# Altium schematic sheet microSD_Display.SchDoc
size A2; SheetNumber: 3; SheetTotal: 3
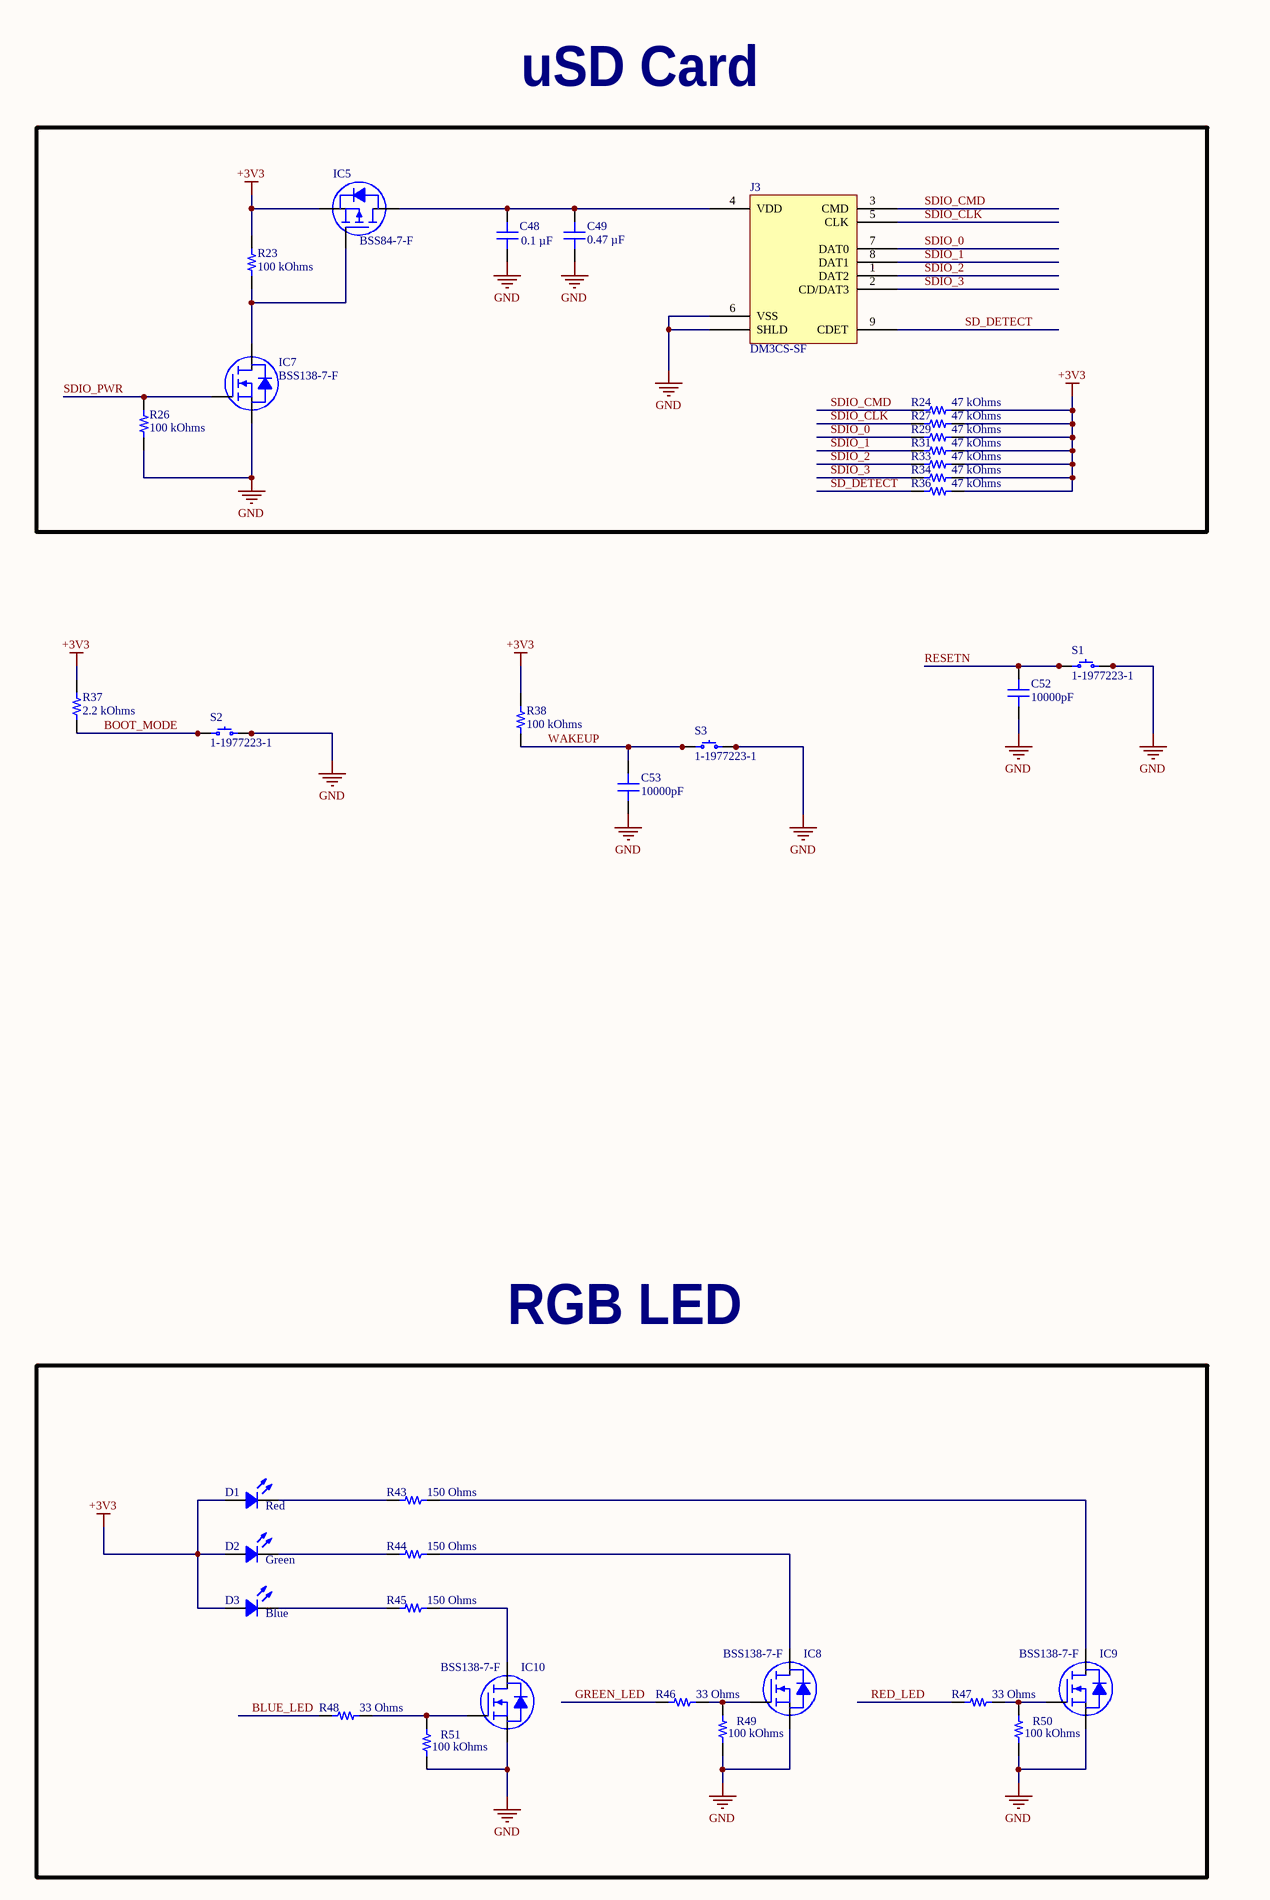
[diagram p0: microSD_Display.SchDoc, left]
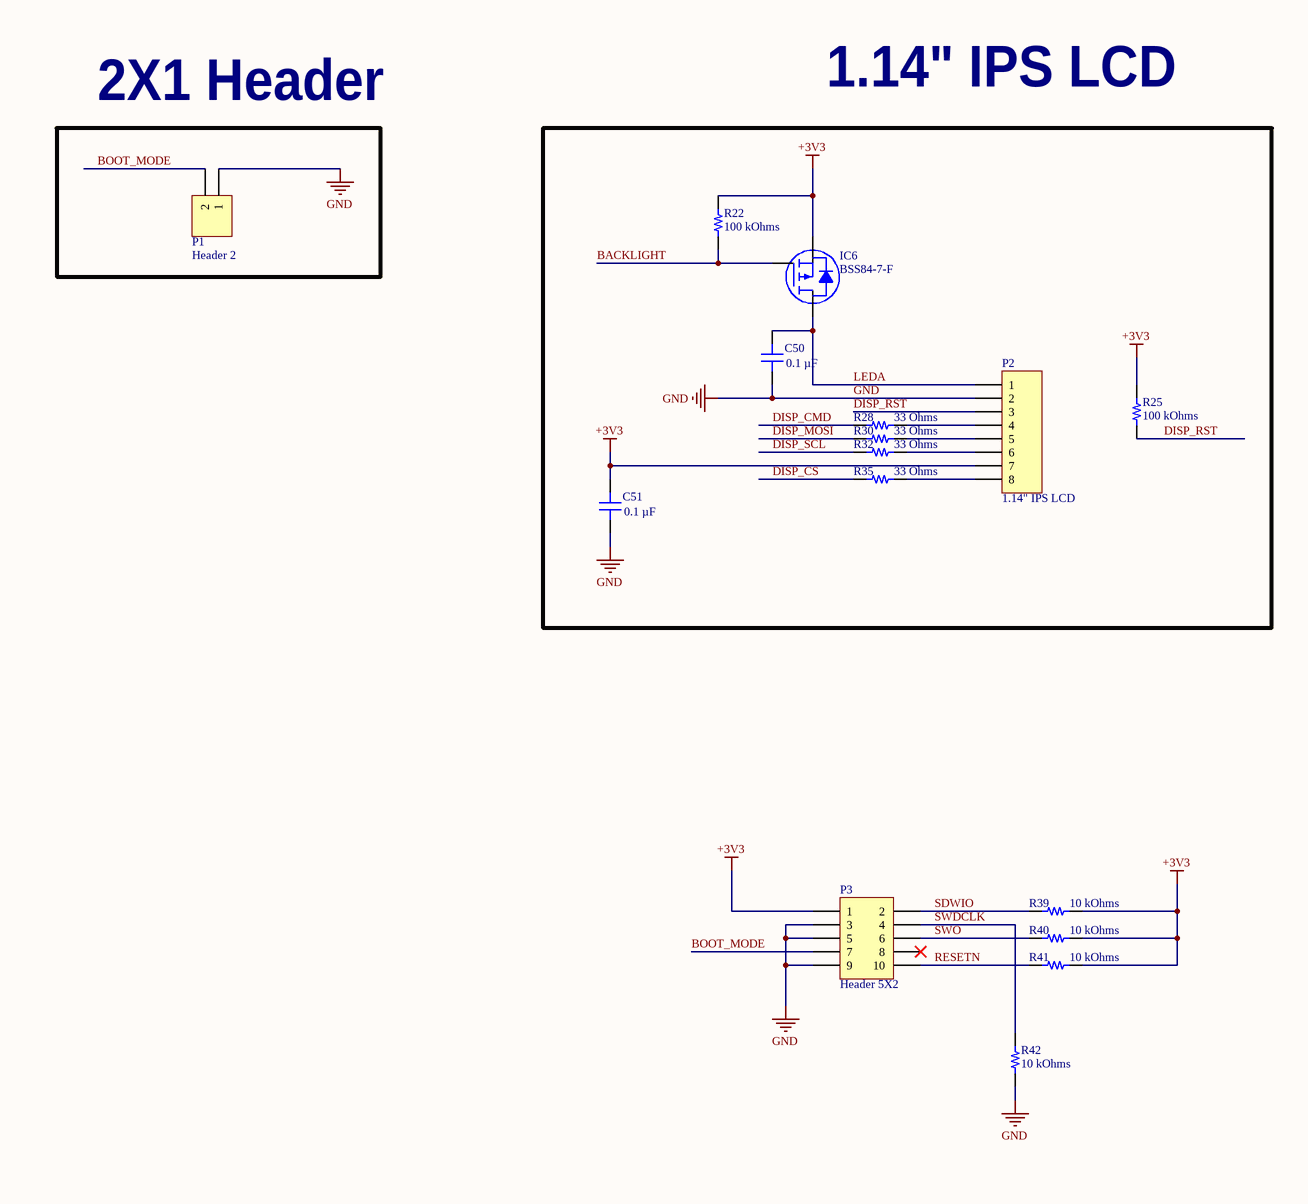
[diagram p1: microSD_Display.SchDoc, right]

## Parts
C48  0.1 µF  [CAP 0603_1608]
C49  0.47 µF  [CAP 0603_1608]
C50  0.1 µF  [CAP 0603_1608]
C51  0.1 µF  [CAP 0603_1608]
C52  10000pF  [CAP 0603_1608]
C53  10000pF  [CAP 0603_1608]
D1  Red  [LED 0603_1608 RED]
D2  Green  [LED 0603_1608 GREEN]
D3  Blue  [LED 0603_1608 BLUE]
IC5  BSS84-7-F  [DIODES SOT-23-3]
IC6  BSS84-7-F  [DIODES SOT-23-3]
IC7  BSS138-7-F  [DIODES SOT-23-3]
IC8  BSS138-7-F  [DIODES SOT-23-3]
IC9  BSS138-7-F  [DIODES SOT-23-3]
IC10  BSS138-7-F  [DIODES SOT-23-3]
J3  DM3CS-SF  [HIROSE DM3CS]
P1  Header 2  [HDR1X2]
P2  1.14" IPS LCD  [HDR1X8]
P3  Header 5X2  [HDR2X5]
R22  100 kOhms  [RES 0603_1608]
R23  100 kOhms  [RES 0603_1608]
R24  47 kOhms  [RES 0603_1608]
R25  100 kOhms  [RES 0603_1608]
R26  100 kOhms  [RES 0603_1608]
R27  47 kOhms  [RES 0603_1608]
R28  33 Ohms  [RES 0603_1608]
R29  47 kOhms  [RES 0603_1608]
R30  33 Ohms  [RES 0603_1608]
R31  47 kOhms  [RES 0603_1608]
R32  33 Ohms  [RES 0603_1608]
R33  47 kOhms  [RES 0603_1608]
R34  47 kOhms  [RES 0603_1608]
R35  33 Ohms  [RES 0603_1608]
R36  47 kOhms  [RES 0603_1608]
R37  2.2 kOhms  [RES 0603_1608]
R38  100 kOhms  [RES 0603_1608]
R39  10 kOhms  [RES 0603_1608]
R40  10 kOhms  [RES 0603_1608]
R41  10 kOhms  [RES 0603_1608]
R42  10 kOhms  [RES 0603_1608]
R43  150 Ohms  [RES 0603_1608]
R44  150 Ohms  [RES 0603_1608]
R45  150 Ohms  [RES 0603_1608]
R46  33 Ohms  [RES 0603_1608]
R47  33 Ohms  [RES 0603_1608]
R48  33 Ohms  [RES 0603_1608]
R49  100 kOhms  [RES 0603_1608]
R50  100 kOhms  [RES 0603_1608]
R51  100 kOhms  [RES 0603_1608]
S1  1-1977223-1  [TE FSM4JSMA]
S2  1-1977223-1  [TE FSM4JSMA]
S3  1-1977223-1  [TE FSM4JSMA]

## Blocks framed on the sheet
2X1 Header: P1

## Nets
+3V3: C51.2 D1.1 D2.1 D3.1 IC5.2(S) IC6.2(S) P2.7 P3.1 R22.2 R23.2 R24.2 R25.2 R27.2 R29.2 R31.2 R33.2 R34.2 R36.2 R37.2 R38.2 R39.2 R40.2 R41.2
GND: C48.1 C49.1 C50.1 C51.1 C52.1 C53.1 IC7.2(S) IC8.2(S) IC9.2(S) IC10.2(S) J3.6(VSS) J3.S(SHLD) P1.1 P2.2 P3.3 P3.5 P3.9 R26.1 R42.1 R49.1 R50.1 R51.1 S1.3 S1.4 S2.3 S2.4 S3.3 S3.4
BACKLIGHT: IC6.1(G) R22.1
BLUE_LED: R48.1
BOOT_MODE: P1.2 P3.7 R37.1 S2.1 S2.2
DISP_CMD: R28.1
DISP_CS: R35.1
DISP_MOSI: R30.1
DISP_RST: P2.3 R25.1
DISP_SCL: R32.1
GREEN_LED: R46.1
LEDA: C50.2 IC6.3(D) P2.1
RED_LED: R47.1
RESETN: C52.2 P3.10 R41.1 S1.1 S1.2
SD_DETECT: J3.9(CDET) R36.1
SDIO_0: J3.7(DAT0) R29.1
SDIO_1: J3.8(DAT1) R31.1
SDIO_2: J3.1(DAT2) R33.1
SDIO_3: J3.2(CD/DAT3) R34.1
SDIO_CLK: J3.5(CLK) R27.1
SDIO_CMD: J3.3(CMD) R24.1
SDIO_PWR: IC7.1(G) R26.2
SDWIO: P3.2 R39.1
SWDCLK: P3.4 R42.2
SWO: P3.6 R40.1
WAKEUP: C53.2 R38.1 S3.1 S3.2
NetC48_2: C48.2 C49.2 IC5.3(D) J3.4(VDD)
NetD1_2: D1.2 R43.1
NetD2_2: D2.2 R44.1
NetD3_2: D3.2 R45.1
NetIC5_1: IC5.1(G) IC7.3(D) R23.1
NetIC8_1: IC8.1(G) R46.2 R49.2
NetIC8_3: IC8.3(D) R44.2
NetIC9_1: IC9.1(G) R47.2 R50.2
NetIC9_3: IC9.3(D) R43.2
NetIC10_1: IC10.1(G) R48.2 R51.2
NetIC10_3: IC10.3(D) R45.2
NetP2_4: P2.4 R28.2
NetP2_5: P2.5 R30.2
NetP2_6: P2.6 R32.2
NetP2_8: P2.8 R35.2

Not connected (* = marked no-connect by the designer): P3 8*

## Notes on the sheet
- uSD Card
- 1.14" IPS LCD
- RGB LED

## Library data of the parts
C48 C50 C51 = CS0603KRX7R7BB104: CAP CER 0.1UF 16V X7R 0603; manufacturer: Yageo; Tolerance: ±10%; Part Number: CS0603KRX7R7BB104; Value: 0.1 µF; Applications: Boardflex Sensitive; Capacitance: 0.1 µF; componentlink1description: Datasheet; componentlink1url: http://www.yageo.com/NewPortal/yageodocoutput?fileName=/pdf/MLCC/UPY-ST_NPOX7R_16V-to-3KV_5.pdf; componentlink2description: DigiKey Link; componentlink2url: https://www.digikey.com/en/products/detail/yageo/CS0603KRX7R7BB104/6097897; Device Package: 0603 (1608 Metric); Features: Soft Termination; lastupdated: 12.06.2022 00:52:33; Lifecycle Status: Active; Minimum Order: 1; Mounting Type: Surface Mount, MLCC; Operating Temperature: -55°C ~ 125°C; Package / Case: 0603 (1608 Metric); packaging: TapeAndReel; partid: 2286; Part Status: Active; price: 0.02; series: CS; Size / Dimension: 0.063" L x 0.031" W (1.60mm x 0.80mm); Supplier 1: DigiKey; Supplier Part Number 1: 311-3560-1-ND; Temperature Coefficient: X7R; Thickness (Max): 0.037" (0.95mm); Voltage - Rated: 16V
C49 = 0603X474K160CT: CAP CER 0.47UF 16V X5R 0603; manufacturer: Walsin Technology Corporation; Tolerance: ±10%; Part Number: 0603X474K160CT; Value: 0.47 µF; Applications: General Purpose; Capacitance: 0.47 µF; componentlink1description: Datasheet; componentlink1url: http://www.passivecomponent.com/wp-content/uploads/2018/10/MLCC.pdf; componentlink2description: DigiKey Link; componentlink2url: https://www.digikey.com/en/products/detail/walsin-technology-corporation/0603X474K160CT/9355050; Device Package: 0603 (1608 Metric); lastupdated: 19.06.2022 07:49:11; Lifecycle Status: Active; Minimum Order: 1; Mounting Type: Surface Mount, MLCC; Operating Temperature: -55°C ~ 85°C; Package / Case: 0603 (1608 Metric); packaging: TapeAndReel; partid: 41229; Part Status: Active; price: 0.01; series: -; Size / Dimension: 0.063" L x 0.031" W (1.60mm x 0.80mm); Supplier 1: DigiKey; Supplier Part Number 1: 1292-1553-1-ND; Temperature Coefficient: X5R; Thickness (Max): 0.037" (0.95mm); Voltage - Rated: 16V
C52 C53 = 0603YC103KAT2A: CAP CER 10000PF 16V X7R 0603; manufacturer: AVX Corporation; Tolerance: ±10%; Part Number: 0603YC103KAT2A; Value: 10000pF; Applications: General Purpose; Capacitance: 10000pF; componentlink1description: Datasheet; componentlink1url: http://datasheets.avx.com/X7RDielectric.pdf; componentlink2description: DigiKey Link; componentlink2url: http://digikey.com/product-detail/en/avx-corporation/0603YC103KAT2A/478-6209-1-ND/2391408; Device Package: 0603 (1608 Metric); lastupdated: 2.09.2020 01:03:30; Lifecycle Status: Active; Minimum Order: 1; Mounting Type: Surface Mount, MLCC; Operating Temperature: -55°C ~ 125°C; Package / Case: 0603 (1608 Metric); packaging: TapeAndReel; partid: 5681; Part Status: Active; price: 0.02; series: -; Size / Dimension: 0.063" L x 0.032" W (1.60mm x 0.81mm); Supplier 1: DigiKey; Supplier Part Number 1: 478-6209-1-ND; Temperature Coefficient: X7R; Thickness (Max): 0.035" (0.90mm); Voltage - Rated: 16V
D1 = FKR1111C-TR: LED RED DIFFUSED SURFACE MOUNT; Manufacturer: Stanley Electric Co; Configuration: Standard; Current - Test: 20mA; Lens Color: White; Lens Size: 1.20mm x 0.80mm; Lens Style: Rectangle with Flat Top; Millicandela Rating: 310mcd; Voltage - Forward (Vf) (Typ): 2.1V; Wavelength - Dominant: 626nm; Wavelength - Peak: 638nm; Part Number: FKR1111C-TR; Color: Red; ComponentLink1Description: Datasheet; ComponentLink1URL: http://www.stanley-components.com/php/downloaddatafile.php?rp=0,FKR1111C-TR_e.pdf; ComponentLink2Description: DigiKey Link; ComponentLink2URL: https://www.digikey.com/en/products/detail/stanley-electric-co/FKR1111C-TR/6615581; Device Package: 0603 (1608 Metric); Height (Max): 0.80mm; LastUpdated: 19.06.2022 08:33:55; Lens Transparency: Diffused; Lifecycle Status: Active; Minimum Order: 1; Mounting Type: Surface Mount; Package / Case: 0603 (1608 Metric); Packaging: TapeAndReel; PartId: 412; Part Status: Active; Price: 0.09; Series: 1111C; Size / Dimension: 1.60mm L x 0.80mm W; Supplier 1: DigiKey; Supplier Part Number 1: 404-1269-1-ND; Supplier Device Package: 1608; Value: Red
D2 = HSME-C130: LED GREEN DIFFUSED 0603 SMD; Manufacturer: Broadcom Limited; Configuration: Standard; Current - Test: 20mA; Lens Color: White; Lens Size: 1.15mm x 0.80mm; Lens Style: Rectangle with Flat Top; Millicandela Rating: 54mcd; Viewing Angle: 110°; Voltage - Forward (Vf) (Typ): 1.94V; Wavelength - Dominant: 573nm; Wavelength - Peak: 575nm; Part Number: HSME-C130; Color: Green; ComponentLink1Description: Datasheet; ComponentLink1URL: //media.digikey.com/pdf/Data%20Sheets/Avago%20PDFs/HSMx-C130.pdf; ComponentLink2Description: DigiKey Link; ComponentLink2URL: https://www.digikey.com/en/products/detail/broadcom-limited/HSME-C130/2220771; Device Package: 0603 (1608 Metric); Height (Max): 0.35mm; LastUpdated: 19.06.2022 08:33:41; Lens Transparency: Diffused; Lifecycle Status: Active; Minimum Order: 1; Mounting Type: Surface Mount; Package / Case: 0603 (1608 Metric); Packaging: TapeAndReel; PartId: 676; Part Status: Active; Price: 0.10; Series: -; Size / Dimension: 1.60mm L x 0.80mm W; Supplier 1: DigiKey; Supplier Part Number 1: 516-HSME-C130CT-ND; Supplier Device Package: 0603; Value: Green
D3 = 5973604507F: LED BLUE 0603 SMD; Manufacturer: Dialight; Configuration: Standard; Current - Test: 5mA; Lens Color: 0.68mm; Lens Size: 1.20mm x 0.80mm; Lens Style: Rectangle with Flat Top; Millicandela Rating: 40mcd; Voltage - Forward (Vf) (Typ): 2.9V; Wavelength - Dominant: 470nm; Part Number: 5973604507F; Color: Blue; ComponentLink1Description: Datasheet; ComponentLink1URL: http://www.dialightsignalsandcomponents.com/Assets/Drawings/2D_Drawings_DrawingDetailedSpec/NewDrawings/C18367A.pdf; ComponentLink2Description: DigiKey Link; ComponentLink2URL: https://www.digikey.com/en/products/detail/dialight/5973604507F/9385436; Device Package: 0603 (1608 Metric); Height (Max): 0.68mm; LastUpdated: 19.06.2022 08:33:26; Lifecycle Status: Active; Minimum Order: 1; Mounting Type: Surface Mount; Package / Case: 0603 (1608 Metric); Packaging: TapeAndReel; PartId: 822; Part Status: Active; Price: 0.16; Series: 597; Size / Dimension: 1.60mm L x 0.80mm W; Supplier 1: DigiKey; Supplier Part Number 1: 350-4381-1-ND; Supplier Device Package: 0603; Value: Blue
IC5 IC6 = BSS84-7-F: MOSFET P-CH 50V 130MA SOT23-3; Manufacturer: Diodes Incorporated; Current - Continuous Drain (Id) @ 25°C: 130mA (Ta); Drive Voltage (Max Rds On,  Min Rds On): 5V; FET Type: P-Channel; Input Capacitance (Ciss) (Max) @ Vds: 45pF @ 25V; Power Dissipation (Max): 300mW (Ta); Rds On (Max) @ Id, Vgs: 10Ohm @ 100mA, 5V; Vgs (Max): ±20V; Vgs(th) (Max) @ Id: 2V @ 1mA; Part Number: BSS84-7-F; ComponentLink1Description: Datasheet; ComponentLink1URL: https://www.diodes.com/assets/Datasheets/ds30149.pdf; ComponentLink2Description: DigiKey Link; ComponentLink2URL: http://digikey.com/product-detail/en/diodes-incorporated/BSS84-7-F/BSS84-FDICT-ND/717844; Drain to Source Voltage (Vdss): 50V; LastUpdated: 18.06.2022 06:47:32; Lifecycle Status: Active; Minimum Order: 1; Mounting Type: Surface Mount; Operating Temperature: -55°C ~ 150°C (TJ); Package / Case: TO-236-3, SC-59, SOT-23-3; Packaging: TapeAndReel; Part Status: Active; Price: 0.03; Series: -; Supplier 1: DigiKey; Supplier Part Number 1: BSS84-FDICT-ND; Supplier Device Package: SOT-23-3; Technology: MOSFET (Metal Oxide)
IC7-IC10 = BSS138-7-F: MOSFET N-CH 50V 200MA SOT23-3; Manufacturer: Diodes Incorporated; Current - Continuous Drain (Id) @ 25°C: 200mA (Ta); Drive Voltage (Max Rds On,  Min Rds On): 10V; FET Type: N-Channel; Input Capacitance (Ciss) (Max) @ Vds: 50pF @ 10V; Power Dissipation (Max): 300mW (Ta); Rds On (Max) @ Id, Vgs: 3.5Ohm @ 220mA, 10V; Vgs (Max): ±20V; Vgs(th) (Max) @ Id: 1.5V @ 250µA; Part Number: BSS138-7-F; ComponentLink1Description: Datasheet; ComponentLink1URL: https://www.diodes.com/assets/Datasheets/ds30144.pdf; ComponentLink2Description: DigiKey Link; ComponentLink2URL: http://digikey.com/product-detail/en/diodes-incorporated/BSS138-7-F/BSS138-FDICT-ND/717843; Drain to Source Voltage (Vdss): 50V; LastUpdated: 19.06.2022 08:41:52; Lifecycle Status: Active; Minimum Order: 1; Mounting Type: Surface Mount; Operating Temperature: -55°C ~ 150°C (TJ); Package / Case: TO-236-3, SC-59, SOT-23-3; Packaging: TapeAndReel; Part Status: Active; Price: 0.04; Series: -; Supplier 1: DigiKey; Supplier Part Number 1: BSS138-FDICT-ND; Supplier Device Package: SOT-23-3; Technology: MOSFET (Metal Oxide)
J3 = DM3CS-SF: CONN MICRO SD CARD HINGED TYPE; Manufacturer: Hirose Electric Co Ltd; Card Type: Secure Digital - microSD™; Connector Type: Connector; Insertion, Removal Method: Hinged Lid; Number of Positions: 10 (8 + 2); Part Number: DM3CS-SF; ComponentLink1Description: Datasheet; ComponentLink1URL: https://www.hirose.com/product/document?clcode=CL0609-0033-6-00&productname=DM3AT-SF-PEJ2M5&series=DM3&documenttype=Catalog&lang=en&documentid=D49662_en; ComponentLink2Description: DigiKey Link; ComponentLink2URL: //digikey.com/product-detail/en/hirose-electric-co-ltd/DM3CS-SF/HR1972TR-ND/2602739; Contact Finish: Gold; Features: Switch; Height Above Board: 0.072" (1.83mm); LastUpdated: 16.12.2019 20:36:12; Lifecycle Status: 0; Minimum Order: 1; Mounting Feature: Normal, Standard - Top; Mounting Type: Surface Mount, Right Angle; Packaging: TapeAndReel; Part Status: Active; Price: 0.77; Series: DM3; Supplier 1: DigiKey; Supplier Part Number 1: HR1972TR-ND
P1 = Header 2: Header, 2-Pin; LatestRevisionDate: 17-Jul-2002; LatestRevisionNote: Re-released for DXP Platform.; Publisher: Altium Limited
P2 = Header 8: Header, 8-Pin; LatestRevisionDate: 17-Jul-2002; LatestRevisionNote: Re-released for DXP Platform.; Publisher: Altium Limited
P3 = Header 5X2: Header, 5-Pin, Dual row; LatestRevisionDate: 17-Jul-2002; LatestRevisionNote: Re-released for DXP Platform.; Publisher: Altium Limited
R22 R23 R25 R26 R38 R49-R51 = ERA-3AED104V: RES 100 KOHMS 0.5% 1/10W 0603; Manufacturer: Panasonic Electronic Components; Power (Watts): 0.1W, 1/10W; Temperature Coefficient: ±25ppm/°C; Part Number: ERA-3AED104V; Value: 100 kOhms; ComponentLink1Description: Datasheet; ComponentLink1URL: https://industrial.panasonic.com/cdbs/www-data/pdf/RDM0000/AOA0000C307.pdf; ComponentLink2Description: DigiKey Link; ComponentLink2URL: https://www.digikey.com/en/products/detail/panasonic-electronic-components/ERA-3AED104V/9467631; Composition: Thin Film; Device Package: 0603 (1608 Metric); Features: Automotive AEC-Q200; Height - Seated (Max): 0.022" (0.55mm); LastUpdated: 18.06.2022 06:13:53; Lifecycle Status: Active; Minimum Order: 1; Number of Terminations: 2; Operating Temperature: -55°C ~ 155°C; Package / Case: 0603 (1608 Metric); Packaging: TapeAndReel; PartId: 10002; Part Status: Active; Price: 0.01; Ratings: AEC-Q200; Resistance: 100 kOhms; Series: ERA-3A; Size / Dimension: 0.063" L x 0.031" W (1.60mm x 0.80mm); Supplier 1: DigiKey; Supplier Part Number 1: P123902CT-ND; Supplier Device Package: 0603; Tolerance: ±0.5%
R24 R27 R29 R31 R33 R34 R36 = ERJ-UP3J473V: RES 47K OHM 5% 1/4W 0603; Manufacturer: Panasonic Electronic Components; Power (Watts): 0.25W, 1/4W; Temperature Coefficient: ±200ppm/°C; Part Number: ERJ-UP3J473V; Value: 47 kOhms; ComponentLink1Description: Datasheet; ComponentLink1URL: https://b2b-api.panasonic.eu/file_stream/pids/fileversion/4484; ComponentLink2Description: DigiKey Link; ComponentLink2URL: https://www.digikey.com/en/products/detail/panasonic-electronic-components/ERJ-UP3J473V/12092099; Composition: Thick Film; Device Package: 0603 (1608 Metric); Features: Anti-Sulfur, Automotive AEC-Q200, Pulse Withstanding; Height - Seated (Max): 0.022" (0.55mm); LastUpdated: 19.06.2022 08:07:14; Lifecycle Status: Active; Minimum Order: 1; Number of Terminations: 2; Operating Temperature: -55°C ~ 155°C; Package / Case: 0603 (1608 Metric); Packaging: TapeAndReel; PartId: 63295; Part Status: Active; Price: 0.02; Ratings: AEC-Q200; Resistance: 47 kOhms; Series: ERJ-UP3; Size / Dimension: 0.063" L x 0.031" W (1.60mm x 0.80mm); Supplier 1: DigiKey; Supplier Part Number 1: 10-ERJ-UP3J473VCT-ND; Supplier Device Package: 0603; Tolerance: ±5%
R28 R30 R32 R35 R46-R48 = AC0603FR-0733RL: RES SMD 33 OHM 1% 1/10W 0603; Manufacturer: Yageo; Power (Watts): 0.1W, 1/10W; Temperature Coefficient: ±100ppm/°C; Part Number: AC0603FR-0733RL; Value: 33 Ohms; ComponentLink1Description: Datasheet; ComponentLink1URL: https://www.yageo.com/upload/media/product/productsearch/datasheet/rchip/PYu-AC_51_RoHS_L_7.pdf; ComponentLink2Description: DigiKey Link; ComponentLink2URL: https://www.digikey.com/en/products/detail/yageo/AC0603FR-0733RL/5896043; Composition: Thick Film; Device Package: 0603 (1608 Metric); Features: Automotive AEC-Q200, Moisture Resistant; Height - Seated (Max): 0.022" (0.55mm); LastUpdated: 18.06.2022 06:13:30; Lifecycle Status: Active; Minimum Order: 1; Number of Terminations: 2; Operating Temperature: -55°C ~ 155°C; Package / Case: 0603 (1608 Metric); Packaging: CutTape; PartId: 17381; Part Status: Active; Price: 0.01; Ratings: AEC-Q200; Resistance: 33 Ohms; Series: AC; Size / Dimension: 0.063" L x 0.031" W (1.60mm x 0.80mm); Supplier 1: DigiKey; Supplier Part Number 1: YAG3599CT-ND; Supplier Device Package: 0603; Tolerance: ±1%
R37 = AC0603FR-072K2L: RES SMD 2.2K OHM 1% 1/10W 0603; Manufacturer: Yageo; Power (Watts): 0.1W, 1/10W; Temperature Coefficient: ±100ppm/°C; Part Number: AC0603FR-072K2L; Value: 2.2 kOhms; ComponentLink1Description: Datasheet; ComponentLink1URL: https://www.yageo.com/upload/media/product/productsearch/datasheet/rchip/PYu-AC_51_RoHS_L_7.pdf; ComponentLink2Description: DigiKey Link; ComponentLink2URL: https://www.digikey.com/en/products/detail/yageo/AC0603FR-072K2L/2827822; Composition: Thick Film; Device Package: 0603 (1608 Metric); Features: Automotive AEC-Q200, Moisture Resistant; Height - Seated (Max): 0.022" (0.55mm); LastUpdated: 19.06.2022 08:08:05; Lifecycle Status: Active; Minimum Order: 1; Number of Terminations: 2; Operating Temperature: -55°C ~ 155°C; Package / Case: 0603 (1608 Metric); Packaging: CutTape; PartId: 17358; Part Status: Active; Price: 0.01; Ratings: AEC-Q200; Resistance: 2.2 kOhms; Series: AC; Size / Dimension: 0.063" L x 0.031" W (1.60mm x 0.80mm); Supplier 1: DigiKey; Supplier Part Number 1: 311-2.2KLDCT-ND; Supplier Device Package: 0603; Tolerance: ±1%
R39-R42 = AA0603FR-0710KL: RES SMD 10K OHM 1% 1/10W 0603; Manufacturer: Yageo; Power (Watts): 0.1W, 1/10W; Temperature Coefficient: ±150ppm/°C; Part Number: AA0603FR-0710KL; Value: 10 kOhms; ComponentLink1Description: Datasheet; ComponentLink1URL: https://www.yageo.com/upload/media/product/productsearch/datasheet/rchip/PYu-AA_51_RoHS_L_3.pdf; ComponentLink2Description: DigiKey Link; ComponentLink2URL: https://www.digikey.com/en/products/detail/yageo/AA0603FR-0710KL/5888698; Composition: Thick Film; Device Package: 0603 (1608 Metric); Features: Anti-Sulfur, Automotive AEC-Q200, Moisture Resistant; Height - Seated (Max): 0.022" (0.55mm); LastUpdated: 19.06.2022 08:07:19; Lifecycle Status: Active; Minimum Order: 1; Number of Terminations: 2; Operating Temperature: -55°C ~ 155°C; Package / Case: 0603 (1608 Metric); Packaging: TapeAndReel; PartId: 64302; Part Status: Active; Price: 0.01; Ratings: AEC-Q200; Resistance: 10 kOhms; Series: AA; Size / Dimension: 0.063" L x 0.031" W (1.60mm x 0.80mm); Supplier 1: DigiKey; Supplier Part Number 1: 13-AA0603FR-0710KLCT-ND; Supplier Device Package: 0603; Tolerance: ±1%
R43-R45 = CR0603-JW-151ELF: RES SMD 150 OHM 5% 1/10W 0603; Manufacturer: Bourns Inc.; Power (Watts): 0.1W, 1/10W; Temperature Coefficient: ±200ppm/°C; Part Number: CR0603-JW-151ELF; Value: 150 Ohms; ComponentLink1Description: Datasheet; ComponentLink1URL: https://www.bourns.com/docs/Product-Datasheets/CHPREZTR.pdf; ComponentLink2Description: DigiKey Link; ComponentLink2URL: https://www.digikey.com/en/products/detail/bourns-inc/CR0603-JW-151ELF/3784293; Composition: Thick Film; Device Package: 0603 (1608 Metric); Features: Moisture Resistant; Height - Seated (Max): 0.022" (0.55mm); LastUpdated: 19.06.2022 08:07:48; Lifecycle Status: Active; Minimum Order: 1; Number of Terminations: 2; Operating Temperature: -55°C ~ 155°C; Package / Case: 0603 (1608 Metric); Packaging: CutTape; PartId: 23012; Part Status: Active; Price: 0.01; Resistance: 150 Ohms; Series: CR0603; Size / Dimension: 0.063" L x 0.031" W (1.60mm x 0.80mm); Supplier 1: DigiKey; Supplier Part Number 1: CR0603-JW-151ELFCT-ND; Supplier Device Package: 0603; Tolerance: ±5%
S1-S3 = 1-1977223-1: SWITCH TACTILE SPST-NO 0.05A 24V; Manufacturer: TE Connectivity ALCOSWITCH Switches; Actuator Height off PCB, Vertical: 5.00mm; Actuator Orientation: Top Actuated; Actuator Type: Standard; Contact Rating @ Voltage: 0.05A @ 24VDC; Illumination: Non-Illuminated; Operating Force: 260gf; Outline: 6.00mm x 6.00mm; Switch Function: Off-Mom; Part Number: 1-1977223-1; Circuit: SPST-NO; ComponentLink1Description: Datasheet; ComponentLink1URL: https://www.te.com/commerce/DocumentDelivery/DDEController?Action=srchrtrv&DocNm=1308111-1_SWITCHES_CORE_PROGRAM_CATALOG&DocType=CS&DocLang=English; ComponentLink2Description: DigiKey Link; ComponentLink2URL: http://digikey.com/product-detail/en/te-connectivity-alcoswitch-switches/1-1977223-1/1-1977223-1-ND/5597032; LastUpdated: 19.06.2022 08:44:29; Lifecycle Status: Active; Minimum Order: 0; Mounting Type: Surface Mount; Price: 0; Series: FSMJSMA; Supplier 1: DigiKey; Supplier Part Number 1: 1-1977223-1-ND; Termination Style: Gull Wing